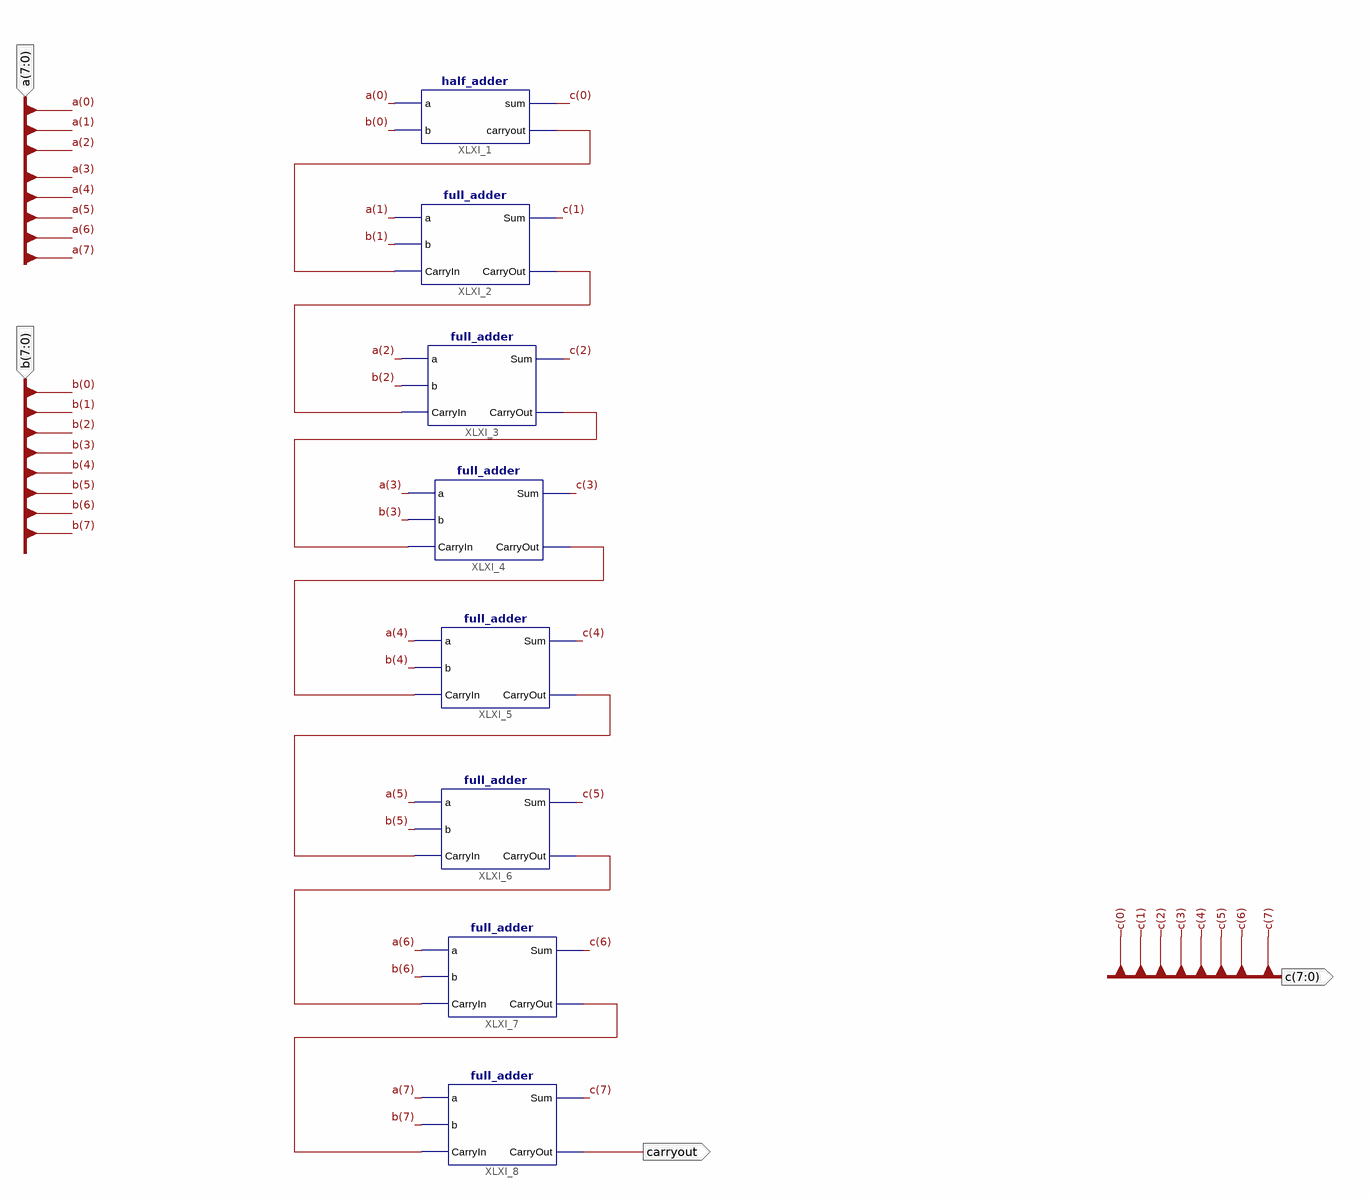
[diagram p0: schematic sheet 1]
// Xilinx ISE schematic adder8Bit.sch (spartan6) as structural Verilog: 8 symbols, 4 ports
module adder8Bit (
  input  [7:0] a,
  input  [7:0] b,
  output [7:0] c,
  output carryout
);

  wire XLXN_33, XLXN_34, XLXN_38, XLXN_39, XLXN_40, XLXN_41, XLXN_49;

  half_adder XLXI_1 (.a(a[0]), .b(b[0]), .sum(c[0]), .carryout(XLXN_33));
  full_adder XLXI_2 (.a(a[1]), .b(b[1]), .CarryIn(XLXN_33), .Sum(c[1]), .CarryOut(XLXN_34));
  full_adder XLXI_3 (.a(a[2]), .b(b[2]), .CarryIn(XLXN_34), .Sum(c[2]), .CarryOut(XLXN_38));
  full_adder XLXI_4 (.a(a[3]), .b(b[3]), .CarryIn(XLXN_38), .Sum(c[3]), .CarryOut(XLXN_39));
  full_adder XLXI_5 (.a(a[4]), .b(b[4]), .CarryIn(XLXN_39), .Sum(c[4]), .CarryOut(XLXN_40));
  full_adder XLXI_6 (.a(a[5]), .b(b[5]), .CarryIn(XLXN_40), .Sum(c[5]), .CarryOut(XLXN_41));
  full_adder XLXI_7 (.a(a[6]), .b(b[6]), .CarryIn(XLXN_41), .Sum(c[6]), .CarryOut(XLXN_49));
  full_adder XLXI_8 (.a(a[7]), .b(b[7]), .CarryIn(XLXN_49), .Sum(c[7]), .CarryOut(carryout));
endmodule
